# EasyEDA schematic nonInvAmp.json
TITLE: non inv op amp; REV: 1.0; Date: 2025-09-23; Sheet: 1/1; Drawn By: Sanmitra Goswami AM25B134
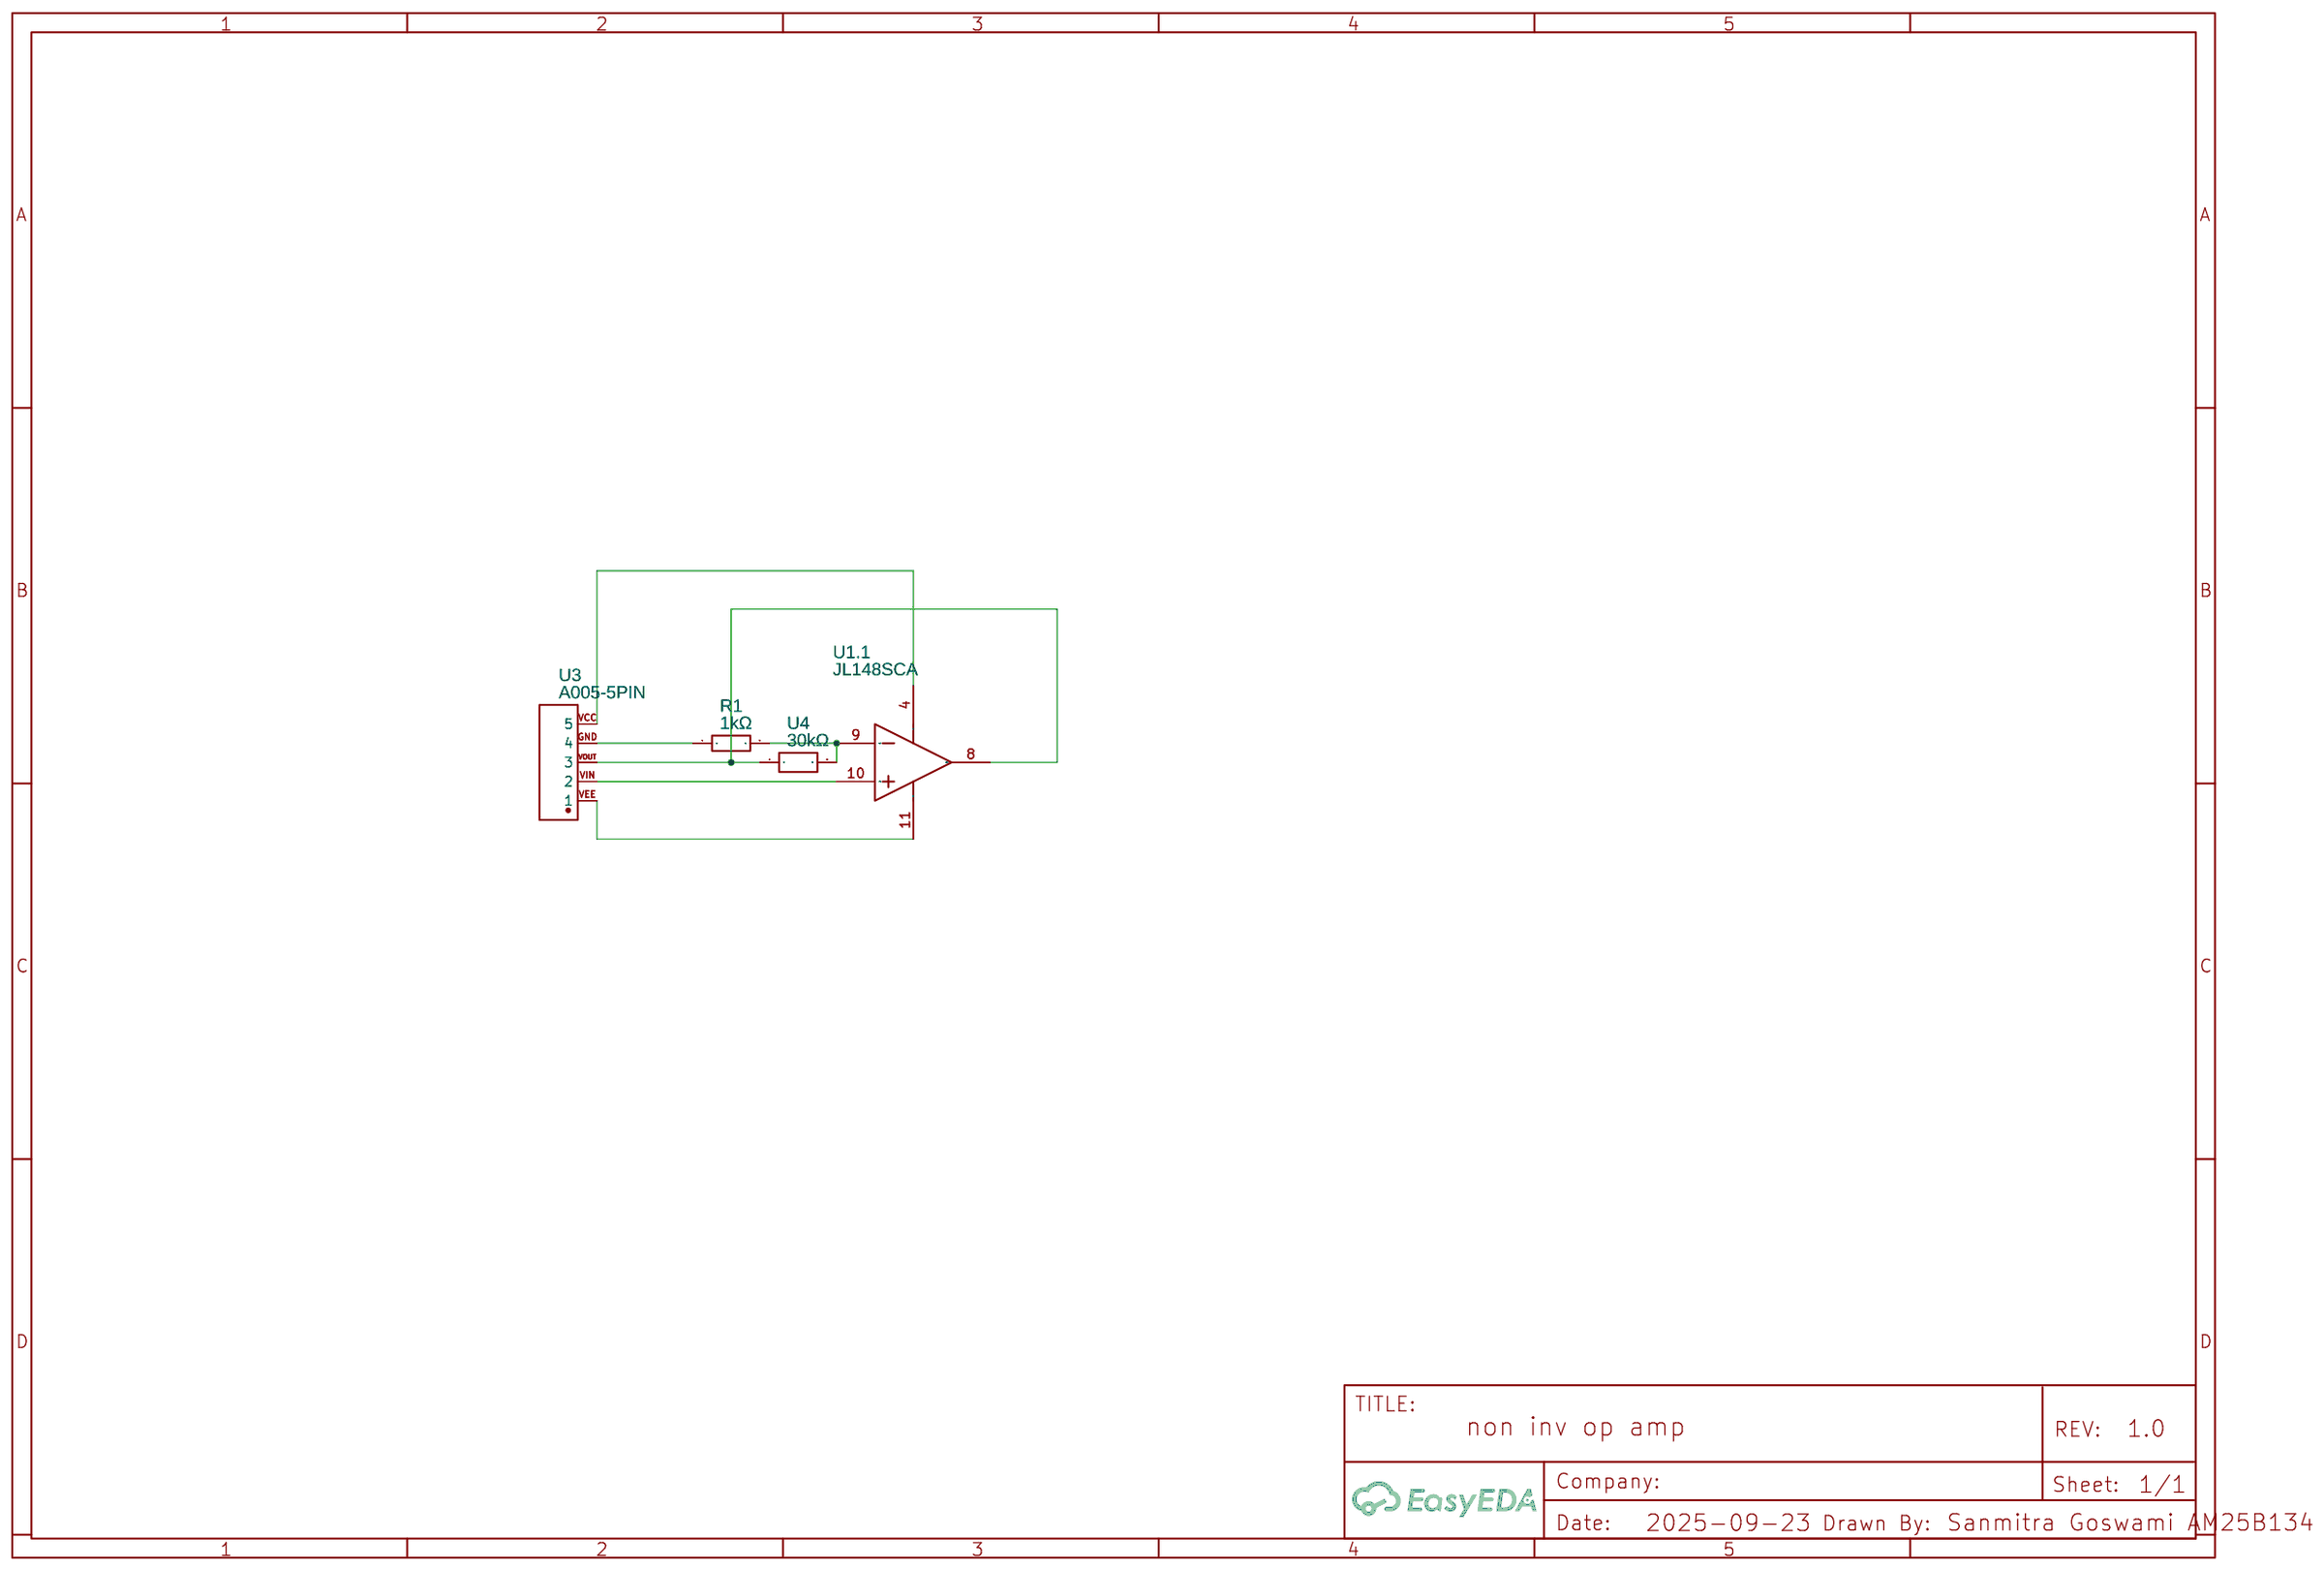
[diagram p0: schematic sheet]

## Parts
R1  1kΩ  [R0402]
U1  JL148SCA  [DIP14]  (section 1)
U3  A005-5PIN  [CONN-TH_A005-5PIN]
U4  30kΩ  [R0402]

## Library data of the parts
R1 = RAT021001FTH: Contributor: lcsc; Supplier: LCSC; Supplier Part: C5122376; Manufacturer: RALEC(旺诠); JLCPCB Part Class: Extended Part
U1 = JL148SCA: Series Quad 741 Op Amp, 14-pin CerDIP; subpart_no: 1
U3 = A005-5PIN: Supplier: LCSC; Supplier Part: C9900174676; Manufacturer: null; Contributor: lcsc
U4 = RT0402BRD0730KL: Supplier: LCSC; Supplier Part: C728558; Manufacturer: YAGEO(国巨); JLCPCB Part Class: Extended Part; Contributor: lcsc

## Nets
Net-(R1-1): R1.1 U3.GND(4)
Net-(R1-2): R1.2 U1.9(IN3-) U4.2
Net-(U1.1-4): U1.4(V+) U3.VCC(5)
Net-(U1.1-8): U1.8(OUT3) U3.VOUT(3) U4.1
Net-(U1.1-10): U1.10(IN3+) U3.VIN(2)
Net-(U1.1-11): U1.11(V-) U3.VEE(1)
